# Altium schematic sheet ChuanGanQi.SchDoc
size A2
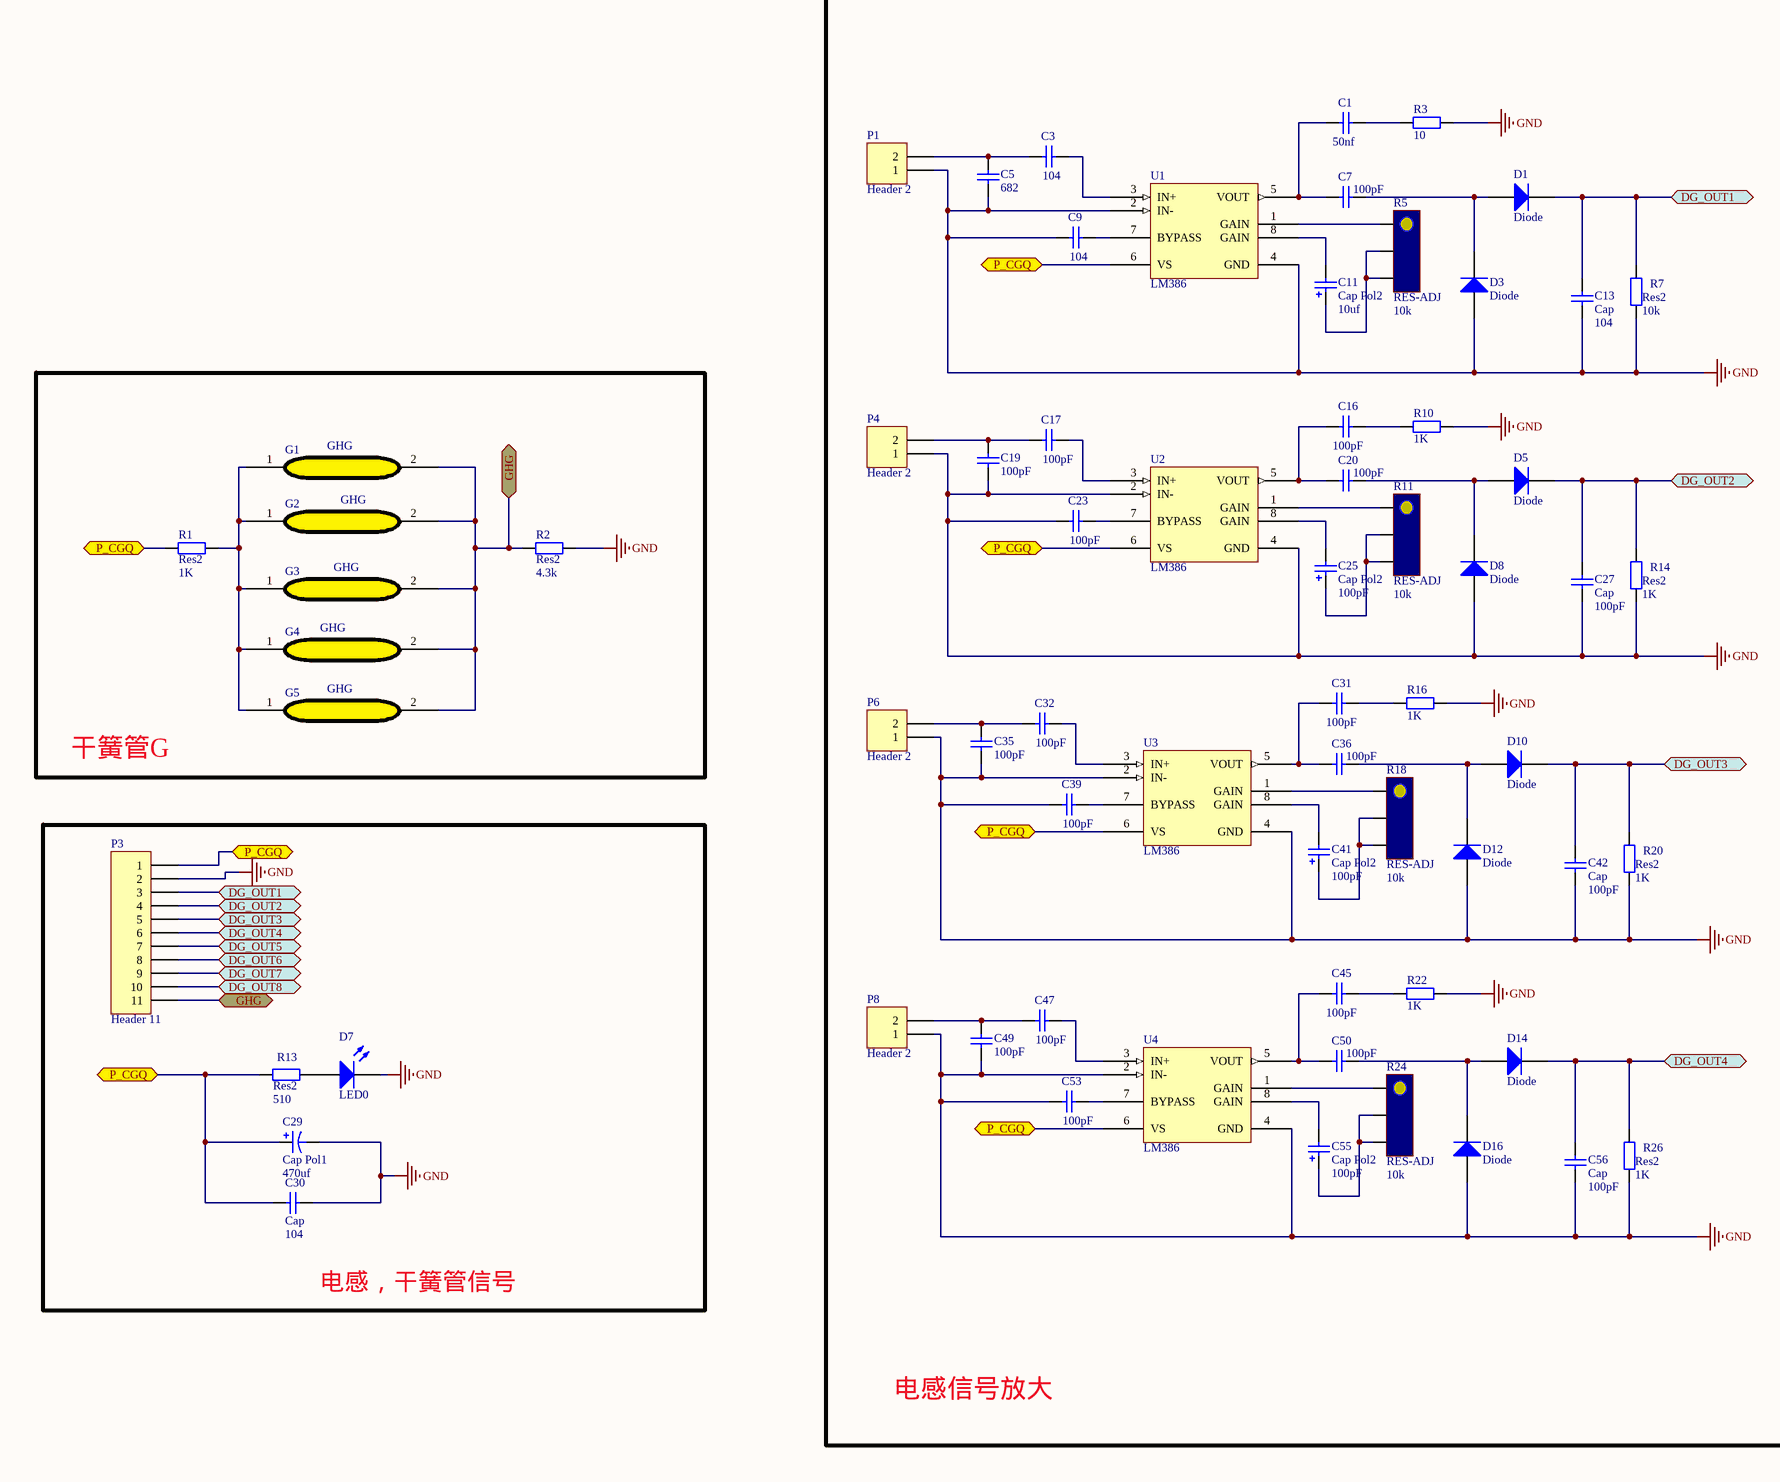
[diagram p0: ChuanGanQi.SchDoc, left]
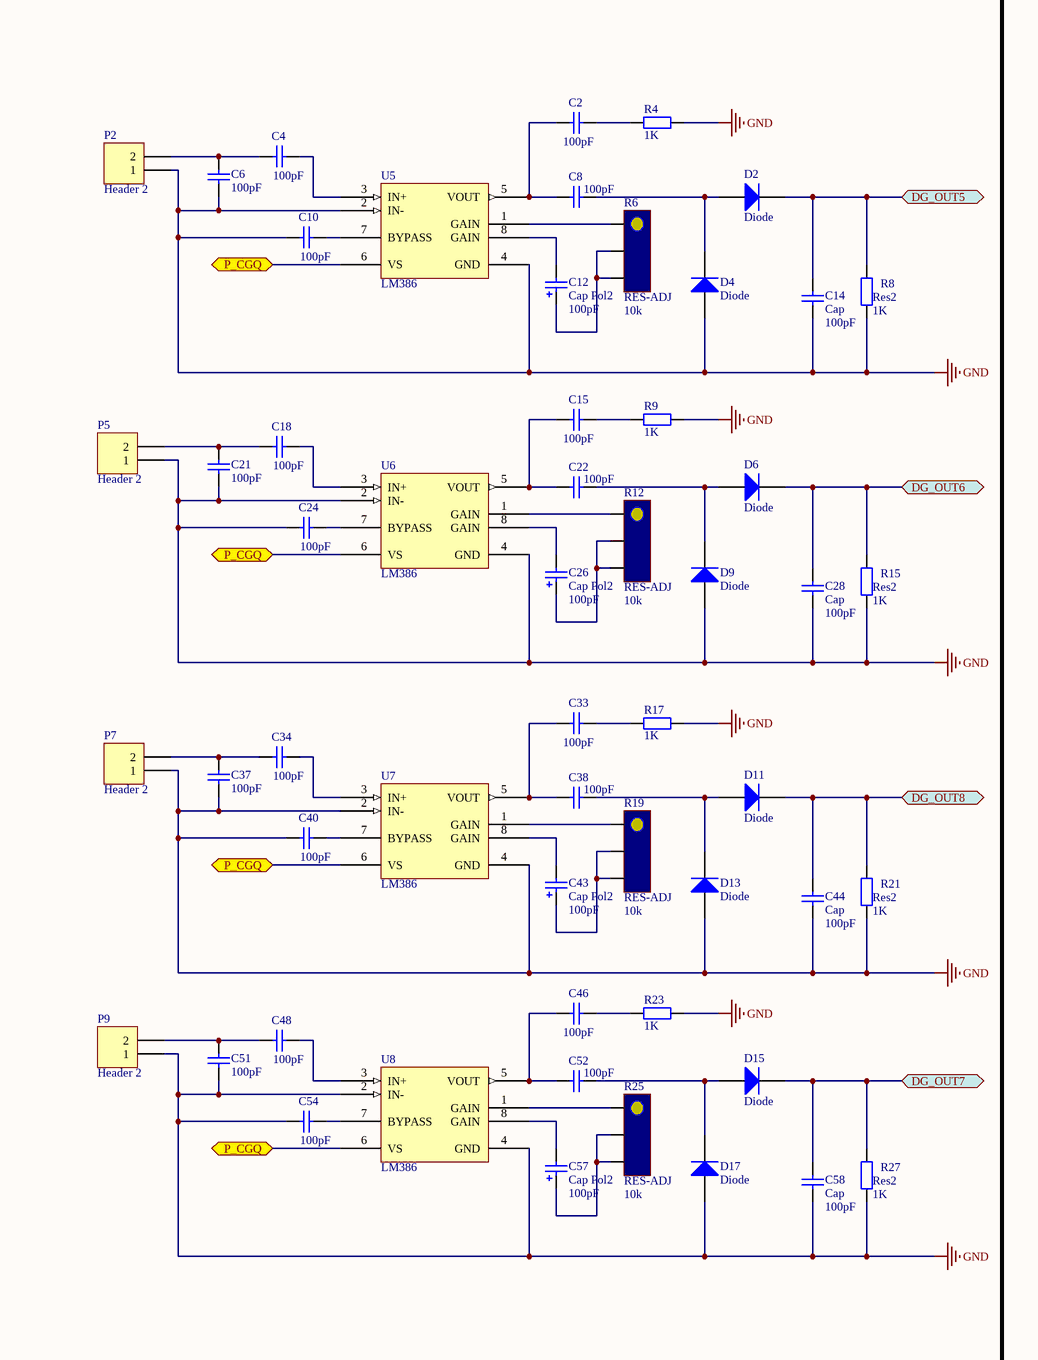
[diagram p1: ChuanGanQi.SchDoc, right]

## Parts
C1  value 50nf  [C-0805]  (hidden comment: Cap)
C2  value 100pF  [C-0805]  (hidden comment: Cap)
C3  value 104  [C-0805]  (hidden comment: Cap)
C4  value 100pF  [C-0805]  (hidden comment: Cap)
C5  value 682  [C-0805]  (hidden comment: Cap)
C6  value 100pF  [C-0805]  (hidden comment: Cap)
C7  value 100pF  [C-0805]  (hidden comment: Cap)
C8  value 100pF  [C-0805]  (hidden comment: Cap)
C9  value 104  [C-0805]  (hidden comment: Cap)
C10  value 100pF  [C-0805]  (hidden comment: Cap)
C11  Cap Pol2  value 10uf  [C-0805]
C12  Cap Pol2  value 100pF  [C-0805]
C13  Cap  value 104  [C-0805]
C14  Cap  value 100pF  [C-0805]
C15  value 100pF  [C-0805]  (hidden comment: Cap)
C16  value 100pF  [C-0805]  (hidden comment: Cap)
C17  value 100pF  [C-0805]  (hidden comment: Cap)
C18  value 100pF  [C-0805]  (hidden comment: Cap)
C19  value 100pF  [C-0805]  (hidden comment: Cap)
C20  value 100pF  [C-0805]  (hidden comment: Cap)
C21  value 100pF  [C-0805]  (hidden comment: Cap)
C22  value 100pF  [C-0805]  (hidden comment: Cap)
C23  value 100pF  [C-0805]  (hidden comment: Cap)
C24  value 100pF  [C-0805]  (hidden comment: Cap)
C25  Cap Pol2  value 100pF  [C-0805]
C26  Cap Pol2  value 100pF  [C-0805]
C27  Cap  value 100pF  [C-0805]
C28  Cap  value 100pF  [C-0805]
C29  Cap Pol1  value 470uf  [1206]
C30  Cap  value 104  [C-0805]
C31  value 100pF  [C-0805]  (hidden comment: Cap)
C32  value 100pF  [C-0805]  (hidden comment: Cap)
C33  value 100pF  [C-0805]  (hidden comment: Cap)
C34  value 100pF  [C-0805]  (hidden comment: Cap)
C35  value 100pF  [C-0805]  (hidden comment: Cap)
C36  value 100pF  [C-0805]  (hidden comment: Cap)
C37  value 100pF  [C-0805]  (hidden comment: Cap)
C38  value 100pF  [C-0805]  (hidden comment: Cap)
C39  value 100pF  [C-0805]  (hidden comment: Cap)
C40  value 100pF  [C-0805]  (hidden comment: Cap)
C41  Cap Pol2  value 100pF  [C-0805]
C42  Cap  value 100pF  [C-0805]
C43  Cap Pol2  value 100pF  [C-0805]
C44  Cap  value 100pF  [C-0805]
C45  value 100pF  [C-0805]  (hidden comment: Cap)
C46  value 100pF  [C-0805]  (hidden comment: Cap)
C47  value 100pF  [C-0805]  (hidden comment: Cap)
C48  value 100pF  [C-0805]  (hidden comment: Cap)
C49  value 100pF  [C-0805]  (hidden comment: Cap)
C50  value 100pF  [C-0805]  (hidden comment: Cap)
C51  value 100pF  [C-0805]  (hidden comment: Cap)
C52  value 100pF  [C-0805]  (hidden comment: Cap)
C53  value 100pF  [C-0805]  (hidden comment: Cap)
C54  value 100pF  [C-0805]  (hidden comment: Cap)
C55  Cap Pol2  value 100pF  [C-0805]
C56  Cap  value 100pF  [C-0805]
C57  Cap Pol2  value 100pF  [C-0805]
C58  Cap  value 100pF  [C-0805]
D1  Diode  [DO214AA]
D2  Diode  [DO214AA]
D3  Diode  [DO214AA]
D4  Diode  [DO214AA]
D5  Diode  [DO214AA]
D6  Diode  [DO214AA]
D7  LED0  [6-0805_N]
D8  Diode  [DO214AA]
D9  Diode  [DO214AA]
D10  Diode  [DO214AA]
D11  Diode  [DO214AA]
D12  Diode  [DO214AA]
D13  Diode  [DO214AA]
D14  Diode  [DO214AA]
D15  Diode  [DO214AA]
D16  Diode  [DO214AA]
D17  Diode  [DO214AA]
G1  GHG  [GHG_MIN]
G2  GHG  [GHG_MIN]
G3  GHG  [GHG_MIN]
G4  GHG  [GHG_MIN]
G5  GHG  [GHG_MIN]
P1  Header 2  [HDR1X2]
P2  Header 2  [HDR1X2]
P3  Header 11  [HDR1X11]
P4  Header 2  [HDR1X2]
P5  Header 2  [HDR1X2]
P6  Header 2  [HDR1X2]
P7  Header 2  [HDR1X2]
P8  Header 2  [HDR1X2]
P9  Header 2  [HDR1X2]
R1  Res2  value 1K  [0805]
R2  Res2  value 4.3k  [0805]
R3  value 10  [0805]  (hidden comment: Res2)
R4  value 1K  [0805]  (hidden comment: Res2)
R5  RES-ADJ  velue: 10k  [T-3224w]
R6  RES-ADJ  velue: 10k  [T-3224w]
R7  Res2  value 10k  [0805]
R8  Res2  value 1K  [0805]
R9  value 1K  [0805]  (hidden comment: Res2)
R10  value 1K  [0805]  (hidden comment: Res2)
R11  RES-ADJ  velue: 10k  [T-3224w]
R12  RES-ADJ  velue: 10k  [T-3224w]
R13  Res2  value 510  [0805]
R14  Res2  value 1K  [0805]
R15  Res2  value 1K  [0805]
R16  value 1K  [0805]  (hidden comment: Res2)
R17  value 1K  [0805]  (hidden comment: Res2)
R18  RES-ADJ  velue: 10k  [T-3224w]
R19  RES-ADJ  velue: 10k  [T-3224w]
R20  Res2  value 1K  [0805]
R21  Res2  value 1K  [0805]
R22  value 1K  [0805]  (hidden comment: Res2)
R23  value 1K  [0805]  (hidden comment: Res2)
R24  RES-ADJ  velue: 10k  [T-3224w]
R25  RES-ADJ  velue: 10k  [T-3224w]
R26  Res2  value 1K  [0805]
R27  Res2  value 1K  [0805]
U1  LM386  [SO-8]
U2  LM386  [SO-8]
U3  LM386  [SO-8]
U4  LM386  [SO-8]
U5  LM386  [SO-8]
U6  LM386  [SO-8]
U7  LM386  [SO-8]
U8  LM386  [SO-8]

## Blocks framed on the sheet
电感信号放大: C1-C28 C31-C58 D1-D6 D8-D17 P1 P2 P4-P9 R3-R12 R14-R27 U1-U8
干簧管G: G1-G5 R1 R2
电感，干簧管信号: C29 C30 D7 P3 R13

## Ports
DG_OUT1, DG_OUT2, DG_OUT3, DG_OUT4, DG_OUT5, DG_OUT6, DG_OUT7, DG_OUT8, GHG, P_CGQ

## Nets
GND: C5.1 C6.1 C9.1 C10.1 C13.1 C14.1 C19.1 C21.1 C23.1 C24.1 C27.1 C28.1 C29.2 C30.1 C35.1 C37.1 C39.1 C40.1 C42.1 C44.1 C49.1 C51.1 C53.1 C54.1 C56.1 C58.1 D3.1(A) D4.1(A) D7.2(K) D8.1(A) D9.1(A) D12.1(A) D13.1(A) D16.1(A) D17.1(A) P1.1 P2.1 P3.2 P4.1 P5.1 P6.1 P7.1 P8.1 P9.1 R2.2 R3.2 R4.2 R7.1 R8.1 R9.2 R10.2 R14.1 R15.1 R16.2 R17.2 R20.1 R21.1 R22.2 R23.2 R26.1 R27.1 U1.2(IN-) U1.4(GND) U2.2(IN-) U2.4(GND) U3.2(IN-) U3.4(GND) U4.2(IN-) U4.4(GND) U5.2(IN-) U5.4(GND) U6.2(IN-) U6.4(GND) U7.2(IN-) U7.4(GND) U8.2(IN-) U8.4(GND)
DG_OUT1: C13.2 D1.2(K) P3.3 R7.2 ; port DG_OUT1
DG_OUT2: C27.2 D5.2(K) P3.4 R14.2 ; port DG_OUT2
DG_OUT3: C42.2 D10.2(K) P3.5 R20.2 ; port DG_OUT3
DG_OUT4: C56.2 D14.2(K) P3.6 R26.2 ; port DG_OUT4
DG_OUT5: C14.2 D2.2(K) P3.7 R8.2 ; port DG_OUT5
DG_OUT6: C28.2 D6.2(K) P3.8 R15.2 ; port DG_OUT6
DG_OUT7: C58.2 D15.2(K) P3.9 R27.2 ; port DG_OUT7
DG_OUT8: C44.2 D11.2(K) P3.10 R21.2 ; port DG_OUT8
GHG: G1.2(PIN) G2.2(PIN) G3.2(PIN) G4.2(PIN) G5.2(PIN) P3.11 R2.1 ; port GHG
P_CGQ: C29.1 C30.2 P3.1 R1.1 R13.1 U1.6(VS) U2.6(VS) U3.6(VS) U4.6(VS) U5.6(VS) U6.6(VS) U7.6(VS) U8.6(VS) ; port P_CGQ
NetC1_1: C1.1 C7.2 U1.5(VOUT)
NetC1_2: C1.2 R3.1
NetC2_1: C2.1 C8.2 U5.5(VOUT)
NetC2_2: C2.2 R4.1
NetC3_1: C3.1 C5.2 P1.2
NetC3_2: C3.2 U1.3(IN+)
NetC4_1: C4.1 C6.2 P2.2
NetC4_2: C4.2 U5.3(IN+)
NetC7_1: C7.1 D1.1(A) D3.2(K)
NetC8_1: C8.1 D2.1(A) D4.2(K)
NetC9_2: C9.2 U1.7(BYPASS)
NetC10_2: C10.2 U5.7(BYPASS)
NetC11_1: C11.1 R5.1 R5.2
NetC11_2: C11.2 U1.8(GAIN)
NetC12_1: C12.1 R6.1 R6.2
NetC12_2: C12.2 U5.8(GAIN)
NetC15_1: C15.1 C22.2 U6.5(VOUT)
NetC15_2: C15.2 R9.1
NetC16_1: C16.1 C20.2 U2.5(VOUT)
NetC16_2: C16.2 R10.1
NetC17_1: C17.1 C19.2 P4.2
NetC17_2: C17.2 U2.3(IN+)
NetC18_1: C18.1 C21.2 P5.2
NetC18_2: C18.2 U6.3(IN+)
NetC20_1: C20.1 D5.1(A) D8.2(K)
NetC22_1: C22.1 D6.1(A) D9.2(K)
NetC23_2: C23.2 U2.7(BYPASS)
NetC24_2: C24.2 U6.7(BYPASS)
NetC25_1: C25.1 R11.1 R11.2
NetC25_2: C25.2 U2.8(GAIN)
NetC26_1: C26.1 R12.1 R12.2
NetC26_2: C26.2 U6.8(GAIN)
NetC31_1: C31.1 C36.2 U3.5(VOUT)
NetC31_2: C31.2 R16.1
NetC32_1: C32.1 C35.2 P6.2
NetC32_2: C32.2 U3.3(IN+)
NetC33_1: C33.1 C38.2 U7.5(VOUT)
NetC33_2: C33.2 R17.1
NetC34_1: C34.1 C37.2 P7.2
NetC34_2: C34.2 U7.3(IN+)
NetC36_1: C36.1 D10.1(A) D12.2(K)
NetC38_1: C38.1 D11.1(A) D13.2(K)
NetC39_2: C39.2 U3.7(BYPASS)
NetC40_2: C40.2 U7.7(BYPASS)
NetC41_1: C41.1 R18.1 R18.2
NetC41_2: C41.2 U3.8(GAIN)
NetC43_1: C43.1 R19.1 R19.2
NetC43_2: C43.2 U7.8(GAIN)
NetC45_1: C45.1 C50.2 U4.5(VOUT)
NetC45_2: C45.2 R22.1
NetC46_1: C46.1 C52.2 U8.5(VOUT)
NetC46_2: C46.2 R23.1
NetC47_1: C47.1 C49.2 P8.2
NetC47_2: C47.2 U4.3(IN+)
NetC48_1: C48.1 C51.2 P9.2
NetC48_2: C48.2 U8.3(IN+)
NetC50_1: C50.1 D14.1(A) D16.2(K)
NetC52_1: C52.1 D15.1(A) D17.2(K)
NetC53_2: C53.2 U4.7(BYPASS)
NetC54_2: C54.2 U8.7(BYPASS)
NetC55_1: C55.1 R24.1 R24.2
NetC55_2: C55.2 U4.8(GAIN)
NetC57_1: C57.1 R25.1 R25.2
NetC57_2: C57.2 U8.8(GAIN)
NetD7_1: D7.1(A) R13.2
NetG1_1: G1.1(PIN) G2.1(PIN) G3.1(PIN) G4.1(PIN) G5.1(PIN) R1.2
NetR5_3: R5.3 U1.1(GAIN)
NetR6_3: R6.3 U5.1(GAIN)
NetR11_3: R11.3 U2.1(GAIN)
NetR12_3: R12.3 U6.1(GAIN)
NetR18_3: R18.3 U3.1(GAIN)
NetR19_3: R19.3 U7.1(GAIN)
NetR24_3: R24.3 U4.1(GAIN)
NetR25_3: R25.3 U8.1(GAIN)

## Library data of the parts
C1-C10 C13-C24 C27 C28 C30-C40 C42 C44-C54 C56 C58 = Cap: Capacitor; Published: 8-Jun-2000; LatestRevisionDate: 17-Jul-2002; LatestRevisionNote: Re-released for DXP Platform.; PackageReference: RAD-0.3; Publisher: Altium Limited; PackageDescription: Radial Cap, Thru-Hole; 2 Leads; 0.3 in Pin Spacing
C11 C12 C25 C26 C41 C43 C55 C57 = Cap Pol2: Polarized Capacitor (Axial); Published: 8-Jun-2000; LatestRevisionDate: 17-Jul-2002; LatestRevisionNote: Re-released for DXP Platform.; PackageReference: POLAR0.8; Publisher: Altium Limited; PackageDescription: Polarized Capacitor; 2 Leads
C29 = Cap Pol1: Polarized Capacitor (Radial); Published: 8-Jun-2000; LatestRevisionDate: 17-Jul-2002; LatestRevisionNote: Re-released for DXP Platform.; PackageReference: RB7.6-15; Publisher: Altium Limited; PackageDescription: Polarized Capacitor (Radial); 2 Leads
D1-D6 D8-D17 = Diode: Default Diode; Published: 8-Jun-2000; LatestRevisionDate: 17-Jul-2002; LatestRevisionNote: Re-released for DXP Platform.; PackageVersion: Sep-1996; PackageReference: SMC; Publisher: Altium Limited; PackageDescription: DO-214-AB/SMC; 2 C-Bend Leads; Body 7.9 x 5.9 mm, inc. leads (LxW); Code_JEDEC: DO-214-AB
D7 = LED0: Typical INFRARED GaAs LED; Published: 8-Jun-2000; LatestRevisionDate: 08-Jul-2005; LatestRevisionNote: Mech Layer 1 removed.; PackageReference: LED-0; Publisher: Altium Limited; PackageDescription: LED; 2 Leads
P1 P2 P4-P9 = Header 2: Header, 2-Pin; LatestRevisionDate: 17-Jul-2002; LatestRevisionNote: Re-released for DXP Platform.; Publisher: Altium Limited
P3 = Header 11: Header, 11-Pin; LatestRevisionDate: 17-Jul-2002; LatestRevisionNote: Re-released for DXP Platform.; Publisher: Altium Limited
R1-R4 R7-R10 R13-R17 R20-R23 R26 R27 = Res2: Resistor; Published: 8-Jun-2000; LatestRevisionDate: 17-Jul-2002; LatestRevisionNote: Re-released for DXP Platform.; PackageReference: AXIAL-0.4; Publisher: Altium Limited; PackageDescription: Axial Device, Thru-Hole; 2 Leads; 0.4 in Pin Spacing